# Altium project DE-080717.PrjPcb
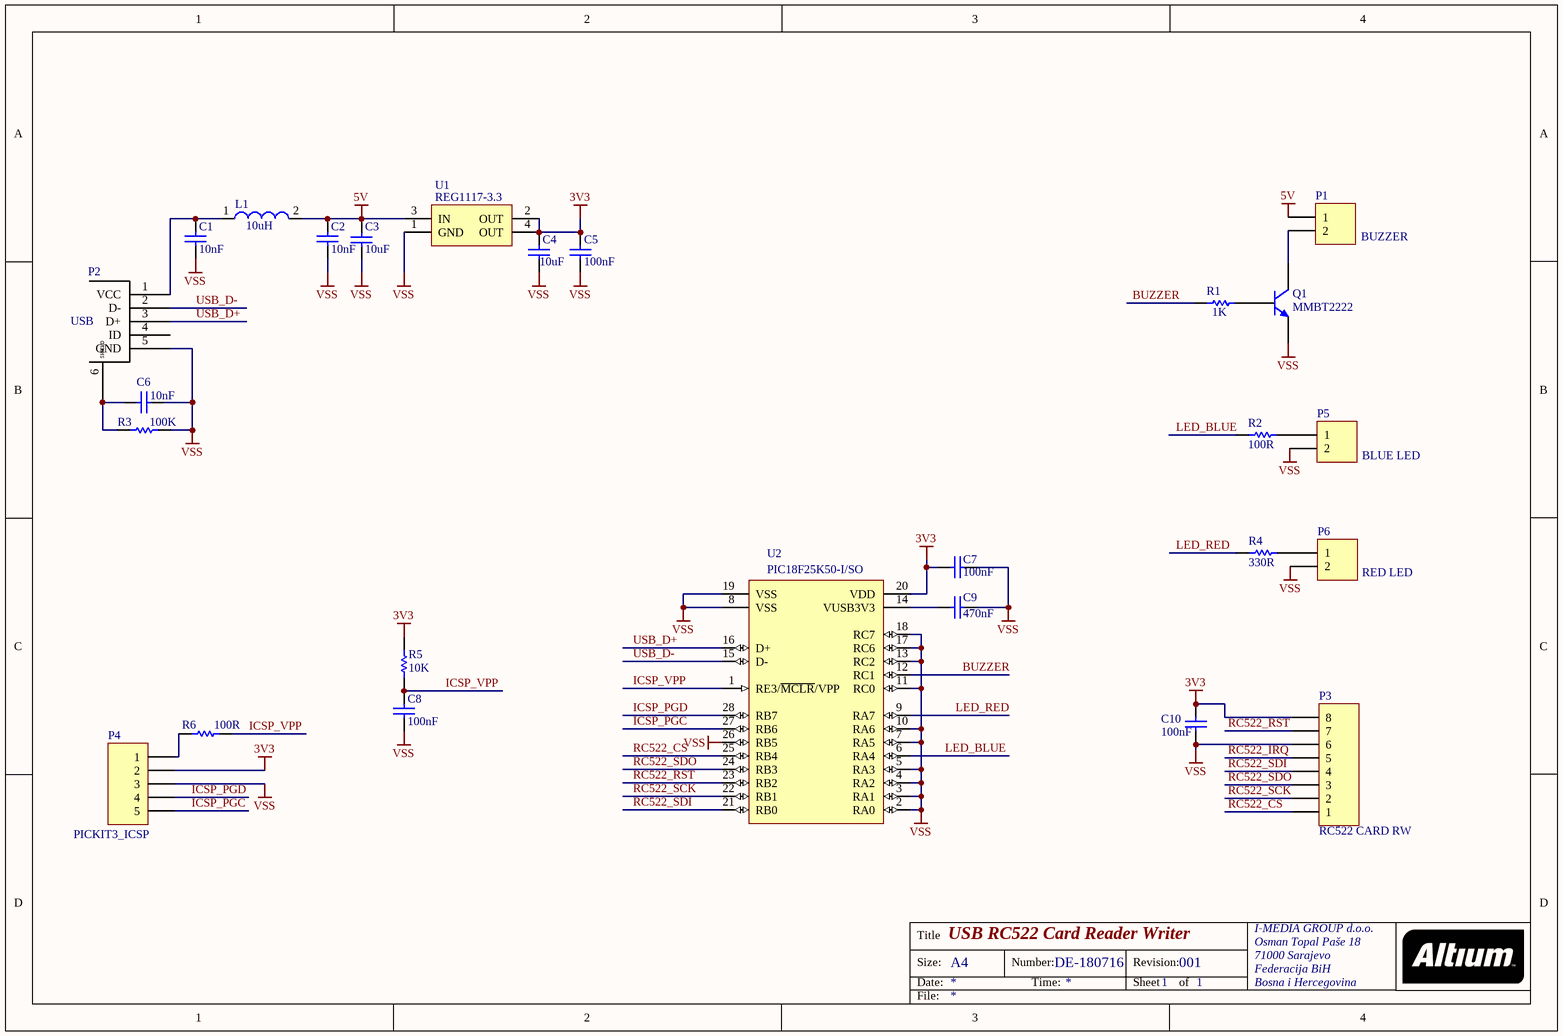
[diagram p0: DE-080717.SchDoc]
1 sheet, 26 parts. Net scope: global (net labels, ports and power ports of the same name join across sheets).
Board file: DE-080717.PcbDoc

## Sheet DE-080717.SchDoc: USB RC522 Card Reader Writer
size A4; Author: eldar6776@hotmail.com; DrawnBy: Eldar Dedic; Organization: I-MEDIA GROUP d.o.o.; Address1: Osman Topal Paše 18; Address2: 71000 Sarajevo; Address3: Federacija BiH; Address4: Bosna i Hercegovina; DocumentNumber: DE-180716; Revision: 001; SheetNumber: 1; SheetTotal: 1; ProjectName: USB_RC522_CARD_RW

### Parts
C1  10nF  [0603]
C2  10nF  [0603]
C3  10uF  [0805]
C4  10uF  [0805]
C5  100nF  [0603]
C6  10nF  [0603]
C7  100nF  [0603]
C8  100nF  [0603]
C9  470nF  [0805]
C10  100nF  [0603]
L1  10uH  [SMD-0805]
P1  BUZZER  [HDR1X2]
P2  USB  [USB mini B]
P3  RC522 CARD RW  [HDR1X8]
P4  PICKIT3_ICSP  [HDR1X5]
P5  BLUE LED  [HDR1X2]
P6  RED LED  [HDR1X2]
Q1  MMBT2222  [SOT23_N]
R1  1K  [ERA-0603]
R2  100R  [ERA-0603]
R3  100K  [ERA-0603]
R4  330R  [ERA-0603]
R5  10K  [ERA-0603]
R6  100R  [ERA-0603]
U1  REG1117-3.3  [ZZ311]
U2  PIC18F25K50-I/SO  [MCHP-SOIC-SO28_N]

### Nets
3V3: C4.2 C5.2 C7.2 C10.1 P3.8 P4.2 R5.2 U1.2(OUT) U1.4(OUT) U2.20(VDD)
5V: C2.1 C3.1 L1.2 P1.1 U1.3(IN)
VSS: C1.2 C2.2 C3.2 C4.1 C5.1 C6.2 C7.1 C8.2 C9.1 C10.2 P2.5(GND) P3.6 P4.3 P5.2 P6.2 Q1.2(E) R3.1 U1.1(GND) U2.2(RA0) U2.3(RA1) U2.4(RA2) U2.5(RA3) U2.7(RA5) U2.8(VSS) U2.10(RA6) U2.11(RC0) U2.13(RC2) U2.17(RC6) U2.18(RC7) U2.19(VSS) U2.26(RB5)
BUZZER: R1.1 U2.12(RC1)
ICSP_PGC: P4.5 U2.27(RB6)
ICSP_PGD: P4.4 U2.28(RB7)
ICSP_VPP: C8.1 R5.1 R6.1 U2.1(RE3/~{MCLR}/VPP)
LED_BLUE: R2.1 U2.6(RA4)
LED_RED: R4.1 U2.9(RA7)
RC522_CS: P3.1 U2.25(RB4)
RC522_IRQ: P3.5
RC522_RST: P3.7 U2.23(RB2)
RC522_SCK: P3.2 U2.22(RB1)
RC522_SDI: P3.4 U2.21(RB0)
RC522_SDO: P3.3 U2.24(RB3)
USB_D+: P2.3(D+) U2.16(D+)
USB_D-: P2.2(D-) U2.15(D-)
NetC1_1: C1.1 L1.1 P2.1(VCC)
NetC6_1: C6.1 P2.6(SHIELD) R3.2
NetC9_2: C9.2 U2.14(VUSB3V3)
NetP1_2: P1.2 Q1.3(C)
NetP4_1: P4.1 R6.2
NetP5_1: P5.1 R2.2
NetP6_1: P6.1 R4.2
NetQ1_1: Q1.1(B) R1.2

Not connected (* = marked no-connect by the designer): P2 4(ID)

### Notes on the sheet
- Title
- Size:
- Date:
- A4
- Number:
- Time:
- Revision:
- Sheet
- of
- File:

### Library data of the parts
C1 C2 C5-C8 C10 = C0603: Ceramic Chip Capacitor - Standard; Note: Footprint corresponds to dimensions for bulk cassette packaging. This case size has tightened tolerances.; Published: 17-Jul-2002; LatestRevisionDate: 19-Mar-2004; LatestRevisionNote: Silkscreen size reduced.; DatasheetDocument: Mar-2001; PackageDocument: Mar-2001; PackageReference: 0603; Publisher: Altium Limited; Code_JEITA: 0603; Code_IPC: 1608 [0603]; ComponentLink1Description: Manufacturer Link; ComponentLink1URL: http://www.kemet.com/; ComponentLink2Description: Datasheet; ComponentLink2URL: http://www.kemet.com/kemet/web/homepage/kechome.nsf/vapubfilesname/F3102TA.pdf/$file/F3102TA.pdf
C3 C4 C9 = C0805: Ceramic Chip Capacitor - Standard; Note: Footprint corresponds to dimensions for bulk cassette packaging. This case size has tightened tolerances.; Published: 17-Jul-2002; LatestRevisionDate: 19-Mar-2004; LatestRevisionNote: Silkscreen size reduced.; DatasheetDocument: Mar-2001; PackageDocument: Mar-2001; PackageReference: 0805; Publisher: Altium Limited; Code_JEITA: 0805; Code_IPC: 2012[0805]; ComponentLink1Description: Manufacturer Link; ComponentLink1URL: http://www.kemet.com/; ComponentLink2Description: Datasheet; ComponentLink2URL: http://www.kemet.com/kemet/web/homepage/kechome.nsf/vapubfilesname/F3102TA.pdf/$file/F3102TA.pdf
L1 = 744790282: SMD-Multilayer Inductor WE-MI, L = 8.20 µH; Inductance: 8.20 µH; DatasheetVersion: ver 1, May-2007; PackageVersion: 2005; PackageReference: SMD-0805; PackageDescription: Chip Inductor, 2-Leads, Body 2.0 x 1.2 mm; ComponentLink1Description: Manufacturer URL; ComponentLink1URL: http://www.we-online.com; ComponentLink2Description: Datasheet; ComponentLink2URL: http://www.we-online.de/katalog/media/pdf/744790282.pdf
P1 P5 P6 = Header 2: Header, 2-Pin; LatestRevisionDate: 17-Jul-2002; LatestRevisionNote: Re-released for DXP Platform.; Publisher: Altium Limited
P2 = USB mini B: USB connector B mini
P3 = Header 8: Header, 8-Pin; LatestRevisionDate: 17-Jul-2002; LatestRevisionNote: Re-released for DXP Platform.; Publisher: Altium Limited
P4 = Header 5: Header, 5-Pin; LatestRevisionDate: 17-Jul-2002; LatestRevisionNote: Re-released for DXP Platform.; Publisher: Altium Limited
Q1 = BC817: NPN General-purpose Transistor; Published: 17-Sep-2003; LatestRevisionDate: 12-Dec-2006; LatestRevisionNote: IPC-7351 Footprint Added.; DatasheetVersion: Jun-1999; PackageVersion: May-1999; PackageReference: SOT23; Publisher: Altium Limited; PackageDescription: 3-Pin SOT-23 Package 0.95 mm Pitch, 2.3 mm Lead Span; ComponentLink1Description: Manufacturer Link; ComponentLink1URL: http://www.semiconductors.philips.com/; ComponentLink2Description: Datasheet; ComponentLink2URL: http://www.semiconductors.philips.com/acrobat/datasheets/BC817_BC817W_BC337_5.pdf
R1-R6 = ERAV: Metal Film Thermosensitive Chip Resistor, 0.56 Ohm to 10k Ohm Range, 5% Tolerance, 0603 Size, 0.063 W; Note: If flow soldering, adjust pad width of PCB Footprint to 0.7 - 0.8 times the width of the resistor.; Published: 17-Dec-2003; LatestRevisionDate: 19-Mar-2004; LatestRevisionNote: Silkscreen size reduced.; PackageDocument: Mar-2003; PackageReference: ERA-0603; Publisher: Altium Limited; Code_IPC: 1608 [0603]; ComponentLink1Description: Manufacturer Link; ComponentLink1URL: http://www.panasonic.com/industrial/components/resistive_products.htm; ComponentLink2Description: Datasheet; ComponentLink2URL: http://www.panasonic.com/industrial/components/pdf/AOF0000CE1.pdf
U1 = REG1117-3.3: 800mA and 1A Low Dropout Positive Regulator 2.85V, 3.3V, 5V, and Adjustable; Published: 8-Jun-2000; LatestRevisionDate: 17-Jul-2002; LatestRevisionNote: Re-released for DXP Platform.; DatasheetVersion: Sep-1997; PackageVersion: revC; PackageReference: ZZ311; Publisher: Altium Limited; PackageDescription: SOT-223/SC-73; 4 Leads; Body 6.7 x 7.3 mm, inc. leads (LxW max); ComponentLink1Description: Manufacturer Link; ComponentLink1URL: http://www.ti.com/; ComponentLink2Description: Datasheet; ComponentLink2URL: http://www-s.ti.com/sc/ds/REG1117.pdf
U2 = PIC18F25K50-I/SO: Low-Power, High-Performance Microcontroller with XLP Technology, 48 MHz, 24 I/O, -40 to 85 degC, 28-pin SOIC (SO28), Tube; Manufacturer: Microchip; # of A/D Channels: 14; Digital Communication: 1 -A/E/USART, 1 -MSSP(SPI/I2C); EEPROM Data Memory (bytes): 256; I/O Pins: 24; Internal Oscillator: 16 MHz, 31 kHz; Max. CPU Speed MHz: 48; Memory Type: Flash; Operation Voltage Range: 1.8V - 5.5V; Program Memory KBytes: 32; Program Memory KWords: 16; RAM: 2048; Timers: 2 - 8-bit, 2 - 16-bit; DatasheetVersion: Rev. A; PackageVersion: C04-052C, 12/2012; PackageReference: SOIC-SO28; PackageDescription: 28-Lead Plastic Small Outline, 17.9 x 7.5 mm Body, 1.27 mm Pitch; Supplier 1: Digi-Key; Supplier Part Number 1: PIC18F25K50-I/SO-ND; Supplier 2: Farnell; Supplier Part Number 2: 2305831; Supplier 3: Newark; Supplier Part Number 3: 06W2972; Supplier 4: Mouser; Supplier Part Number 4: 579-PIC18F25K50-I/SO; Packing: TUBE; RoHS: TRUE; Mounting Technology: Surface Mount; PartNumber: PIC18F25K50-I/SO; ComponentLink1Description: Datasheet; ComponentLink1URL: http://ww1.microchip.com/downloads/en/DeviceDoc/30684A.pdf; ComponentLink2Description: Package Specification; ComponentLink2URL: http://www.microchip.com/stellent/groups/techpub_sg/documents/packagingspec/en012702.pdf; ComponentLink3Description: URL Link1; ComponentLink3URL: Product URL:http://www.microchip.com/datasheet/PIC18F25K50